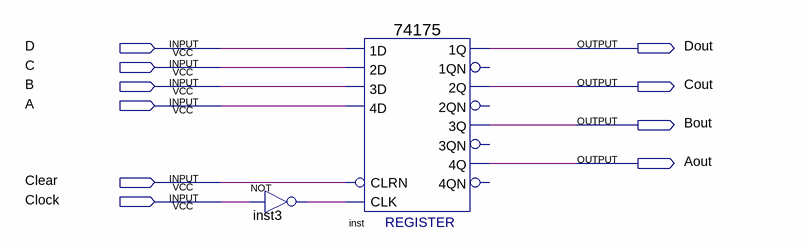
[diagram p0: schematic sheet]
// Quartus schematic Register74175.bdf as structural Verilog: 2 symbols, 10 pins
module Register74175 (
  input  D,
  input  C,
  input  B,
  input  A,
  input  Clear,
  input  Clock,
  output Dout,
  output Cout,
  output Bout,
  output Aout
);

  wire inst3_out;

  not inst3 (inst3_out, Clock);
  \74175  inst (
    .CLRN(Clear), .CLK(inst3_out), .\3D (B), .\2D (C), .\1D (D), .\4D (A), .\1Q (Dout), .\3Q (Bout),
    .\2Q (Cout), .\4Q (Aout));  // open: 1QN, 2QN, 4QN, 3QN
endmodule
